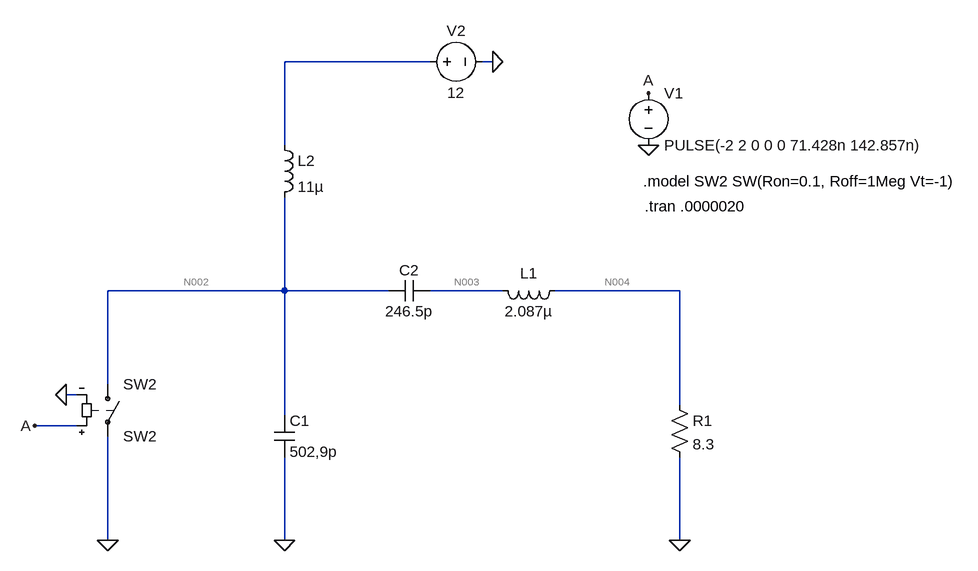
[diagram p0: schematic Clase E FET.asc]
Clase E FET.asc, the LTspice schematic file:
Version 4
SHEET 1 880 680
WIRE 32 -288 -192 -288
WIRE 128 -288 112 -288
WIRE -192 -160 -192 -288
WIRE -192 64 -192 -80
WIRE -192 64 -464 64
WIRE -32 64 -192 64
WIRE 144 64 32 64
WIRE 416 64 224 64
WIRE -464 208 -464 64
WIRE -512 224 -528 224
WIRE 416 240 416 64
WIRE -192 256 -192 64
WIRE -512 272 -576 272
WIRE -464 448 -464 288
WIRE -192 448 -192 320
WIRE 416 448 416 320
FLAG 368 -160 0
FLAG 368 -240 A
FLAG -464 448 0
FLAG -192 448 0
FLAG 416 448 0
FLAG 128 -288 0
FLAG -576 272 A
FLAG -528 224 0
SYMBOL voltage 368 -256 R0
WINDOW 123 0 0 Left 0
WINDOW 39 0 0 Left 0
SYMATTR InstName V1
SYMATTR Value PULSE(-2 2 0 0 0 71.428n 142.857n)
SYMBOL cap -208 256 R0
SYMATTR InstName C1
SYMATTR Value 502,9p
SYMBOL res 400 224 R0
SYMATTR InstName R1
SYMATTR Value 8.3
SYMBOL ind 240 48 R90
WINDOW 0 5 56 VBottom 2
WINDOW 3 32 56 VTop 2
SYMATTR InstName L1
SYMATTR Value 2.087µ
SYMBOL cap 32 48 R90
WINDOW 0 0 32 VBottom 2
WINDOW 3 32 32 VTop 2
SYMATTR InstName C2
SYMATTR Value 246.5p
SYMBOL voltage 16 -288 R270
WINDOW 0 32 56 VTop 2
WINDOW 3 -32 56 VBottom 2
SYMATTR InstName V2
SYMATTR Value 12
SYMBOL ind -208 -176 R0
SYMATTR InstName L2
SYMATTR Value 11µ
SYMBOL sw -464 192 R0
SYMATTR InstName SW2
SYMATTR Value SW2
TEXT 360 -104 Left 2 !.model SW2 SW(Ron=0.1, Roff=1Meg Vt=-1)
TEXT 362 -66 Left 2 !.tran .0000020

The netlist it stands for:
* Clase E FET.asc
V1 A 0 PULSE(-2 2 0 0 0 71.428n 142.857n)
C1 N002 0 502,9p
R1 N004 0 8.3
L1 N004 N003 2.087µ
C2 N003 N002 246.5p
V2 N001 0 12
L2 N001 N002 11µ
SW2 N002 0 A 0 SW2
.model SW2 SW(Ron=0.1, Roff=1Meg Vt=-1)
.tran .0000020
.backanno
.end

* Results of the author's LTspice run, read from the files saved beside the schematic
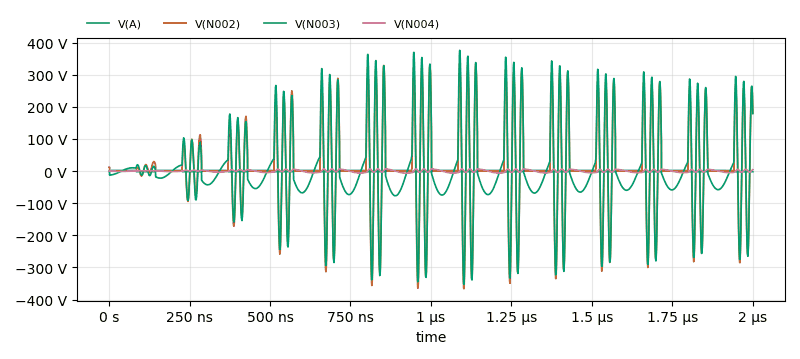
[diagram p1: Transient Analysis of Clase E FET.asc, plotted from the saved traces]
* Transient Analysis, 1 run:
*   V(A): min -2 V, max 2 V, average 200 mV, rms 1.937 V, last -1.999 V
*   V(N002): min -366.4 V, max 332.6 V, average 11.17 V, rms 124.9 V, last 180.7 V
*   V(N003): min -352.6 V, max 375.9 V, average 385.1 mV, rms 133.4 V, last 178.9 V
*   V(N004): min -6.461 V, max 7.384 V, average -11.67 mV, rms 3.691 V, last 4.611 V